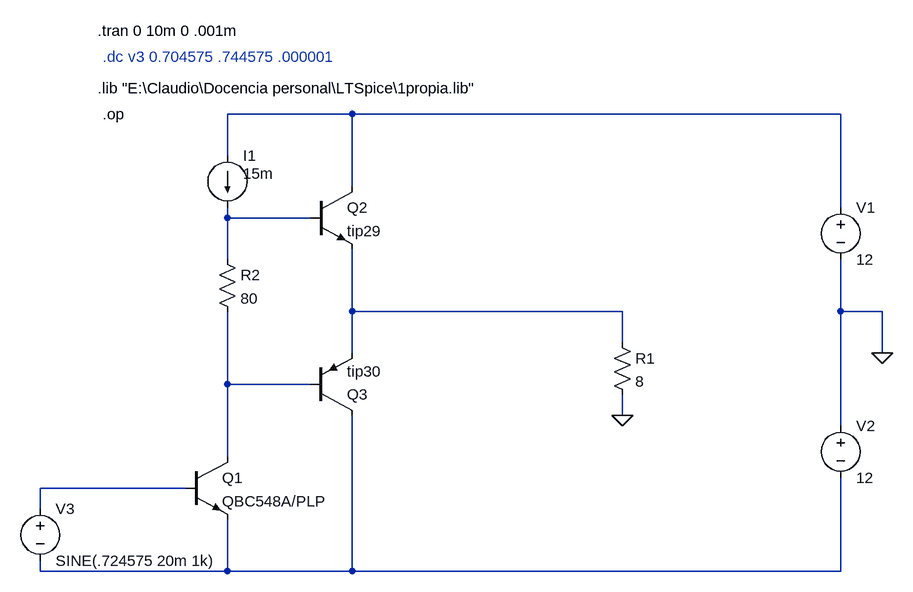
[diagram p0: schematic clase b .asc]
clase b .asc, the LTspice schematic file:
Version 4
SHEET 1 1572 760
WIRE 736 48 544 48
WIRE 1488 48 736 48
WIRE 544 112 544 48
WIRE 736 160 736 48
WIRE 1488 192 1488 48
WIRE 544 208 544 192
WIRE 672 208 544 208
WIRE 544 272 544 208
WIRE 736 352 736 256
WIRE 1152 352 736 352
WIRE 1488 352 1488 272
WIRE 1552 352 1488 352
WIRE 1152 400 1152 352
WIRE 736 416 736 352
WIRE 1552 416 1552 352
WIRE 544 464 544 352
WIRE 672 464 544 464
WIRE 1152 512 1152 480
WIRE 1488 528 1488 352
WIRE 544 576 544 464
WIRE 480 624 256 624
WIRE 256 656 256 624
WIRE 256 752 256 736
WIRE 544 752 544 672
WIRE 544 752 256 752
WIRE 736 752 736 512
WIRE 736 752 544 752
WIRE 1488 752 1488 608
WIRE 1488 752 736 752
FLAG 1152 512 0
FLAG 1552 416 0
DATAFLAG 1024 352 ""
DATAFLAG 608 208 ""
DATAFLAG 592 464 ""
SYMBOL res 1136 384 R0
SYMATTR InstName R1
SYMATTR Value 8
SYMBOL npn 480 576 R0
SYMATTR InstName Q1
SYMATTR Value QBC548A/PLP
SYMBOL current 544 112 R0
WINDOW 3 24 28 Left 2
WINDOW 123 0 0 Left 0
WINDOW 39 0 0 Left 0
SYMATTR Value 15m
SYMATTR InstName I1
SYMBOL voltage 1488 176 R0
WINDOW 123 0 0 Left 0
WINDOW 39 0 0 Left 0
SYMATTR InstName V1
SYMATTR Value 12
SYMBOL voltage 1488 512 R0
WINDOW 123 0 0 Left 0
WINDOW 39 0 0 Left 0
SYMATTR InstName V2
SYMATTR Value 12
SYMBOL voltage 256 640 R0
WINDOW 123 0 0 Left 0
WINDOW 39 0 0 Left 0
SYMATTR InstName V3
SYMATTR Value SINE(.724575 20m 1k)
SYMBOL npn 672 160 R0
SYMATTR InstName Q2
SYMATTR Value tip29
SYMBOL pnp 672 512 M180
SYMATTR InstName Q3
SYMATTR Value tip30
SYMBOL res 528 256 R0
SYMATTR InstName R2
SYMATTR Value 80
TEXT 344 8 Left 2 !.lib "E:\\Claudio\\Docencia personal\\LTSpice\\1propia.lib"
TEXT 352 48 Left 2 !.op
TEXT 352 -40 Left 2 ;.dc v3 0.704575 .744575 .000001
TEXT 344 -80 Left 2 !.tran 0 10m 0 .001m

The netlist it stands for:
* clase b .asc
R1 N003 0 8
Q1 N004 N005 N006 0 QBC548A/PLP
I1 N001 N002 15m
V1 N001 0 12
V2 0 N006 12
V3 N005 N006 SINE(.724575 20m 1k)
Q2 N001 N002 N003 0 tip29
Q3 N006 N004 N003 0 tip30
R2 N002 N004 80
.model NPN NPN
.model PNP PNP
.lib standard.bjt
.lib "E:\Claudio\Docencia personal\LTSpice\1propia.lib"
.op
* .dc v3 0.704575 .744575 .000001
.tran 0 10m 0 .001m
.backanno
.end